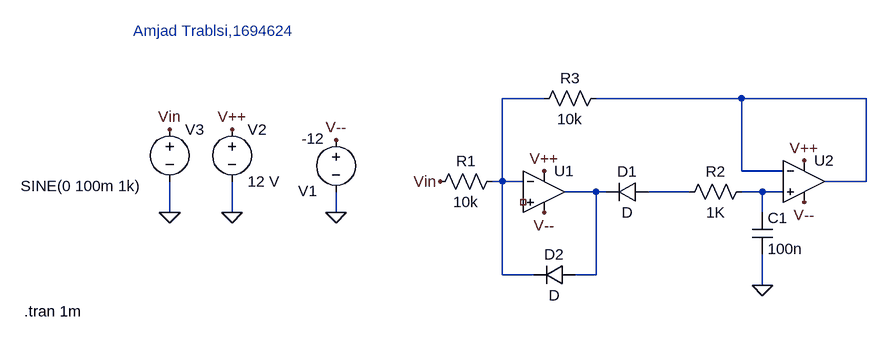
[diagram p0: schematic 3_1_5_SpizenGR_2.asc]
3_1_5_SpizenGR_2.asc, the LTspice schematic file:
Version 4
SHEET 1 880 680
WIRE 304 48 240 48
WIRE 608 48 384 48
WIRE 800 48 608 48
WIRE 608 160 608 48
WIRE 672 160 608 160
WIRE 240 176 240 48
WIRE 240 176 224 176
WIRE 272 176 240 176
WIRE 800 176 800 48
WIRE 800 176 736 176
WIRE 384 192 336 192
WIRE 400 192 384 192
WIRE 528 192 464 192
WIRE 640 192 608 192
WIRE 672 192 640 192
WIRE -272 224 -272 176
WIRE -176 224 -176 176
WIRE -16 224 -16 192
WIRE 640 224 640 192
WIRE 240 320 240 176
WIRE 288 320 240 320
WIRE 384 320 384 192
WIRE 384 320 352 320
WIRE 640 336 640 288
FLAG -176 224 0
FLAG -272 224 0
FLAG -272 96 Vin
FLAG -16 224 0
FLAG -176 96 V++
FLAG 640 336 0
FLAG 144 176 Vin
FLAG 304 160 V++
FLAG 704 144 V++
FLAG -16 112 V--
FLAG 704 208 V--
FLAG 304 224 V--
SYMBOL voltage -16 96 R0
WINDOW 0 -58 95 Left 2
WINDOW 3 -53 14 Left 2
WINDOW 123 0 0 Left 0
WINDOW 39 0 0 Left 0
SYMATTR InstName V1
SYMATTR Value -12
SYMBOL voltage -176 80 R0
WINDOW 123 0 0 Left 0
WINDOW 39 0 0 Left 0
SYMATTR InstName V2
SYMATTR Value 12 V
SYMBOL voltage -272 80 R0
WINDOW 3 -229 103 Left 2
WINDOW 123 0 0 Left 0
WINDOW 39 0 0 Left 0
SYMATTR InstName V3
SYMATTR Value SINE(0 100m 1k)
SYMBOL OpAmps\\UniversalOpAmp 304 192 R0
SYMATTR InstName U1
SYMBOL cap 624 224 R0
SYMATTR InstName C1
SYMATTR Value 100n
SYMBOL OpAmps\\UniversalOpAmp 704 176 R0
SYMATTR InstName U2
SYMBOL res 624 176 R90
WINDOW 0 0 56 VBottom 2
WINDOW 3 32 56 VTop 2
SYMATTR InstName R2
SYMATTR Value 1K
SYMBOL diode 464 176 R90
WINDOW 0 0 32 VBottom 2
WINDOW 3 32 32 VTop 2
SYMATTR InstName D1
SYMBOL diode 352 304 R90
WINDOW 0 0 32 VBottom 2
WINDOW 3 32 32 VTop 2
SYMATTR InstName D2
SYMBOL res 240 160 R90
WINDOW 0 0 56 VBottom 2
WINDOW 3 32 56 VTop 2
SYMATTR InstName R1
SYMATTR Value 10k
SYMBOL res 400 32 R90
WINDOW 0 0 56 VBottom 2
WINDOW 3 32 56 VTop 2
SYMATTR InstName R3
SYMATTR Value 10k
TEXT -328 -56 Left 2 ;Amjad Trablsi,1694624
TEXT -496 376 Left 2 !.tran 1m

The netlist it stands for:
* 3_1_5_SpizenGR_2.asc
V1 V-- 0 -12
V2 V++ 0 12 V
V3 Vin 0 SINE(0 100m 1k)
XU1 NC_01 N001 V++ V-- N003 level1 Avol=1Meg GBW=10Meg Vos=0 En=0 Enk=0 In=0 Ink=0 Rin=500Meg  ; pins In+ In- V+ V- OUT
C1 N005 0 100n
XU2 N005 N002 V++ V-- N002 level1 Avol=1Meg GBW=10Meg Vos=0 En=0 Enk=0 In=0 Ink=0 Rin=500Meg  ; pins In+ In- V+ V- OUT
R2 N005 N004 1K
D1 N004 N003 D
D2 N003 N001 D
R1 N001 Vin 10k
R3 N002 N001 10k
.model D D
.lib standard.dio
* Amjad Trablsi,1694624
.tran 1m
.lib UniversalOpAmp1.lib
.backanno
.end